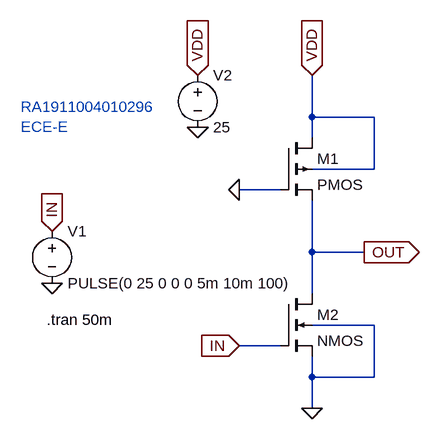
[diagram p0: schematic pseudo nmos.asc]
pseudo nmos.asc, the LTspice schematic file:
Version 4
SHEET 1 880 680
WIRE 256 32 256 -32
WIRE 352 32 256 32
WIRE 256 64 256 32
WIRE 352 112 352 32
WIRE 352 112 256 112
WIRE 208 144 144 144
WIRE 256 240 256 160
WIRE 336 240 256 240
WIRE 256 304 256 240
WIRE 352 352 256 352
WIRE 208 384 144 384
WIRE 256 432 256 400
WIRE 352 432 352 352
WIRE 352 432 256 432
WIRE 256 480 256 432
FLAG 336 240 OUT
IOPIN 336 240 Out
FLAG 144 384 IN
IOPIN 144 384 In
FLAG 144 144 0
FLAG 256 -32 VDD
IOPIN 256 -32 In
FLAG 256 480 0
FLAG 80 -32 VDD
IOPIN 80 -32 In
FLAG 80 48 0
FLAG -144 288 0
FLAG -144 208 IN
IOPIN -144 208 In
SYMBOL pmos4 208 64 R0
SYMATTR InstName M1
SYMBOL nmos4 208 304 R0
SYMATTR InstName M2
SYMBOL voltage -144 192 R0
WINDOW 123 0 0 Left 0
WINDOW 39 0 0 Left 0
SYMATTR InstName V1
SYMATTR Value PULSE(0 25 0 0 0 5m 10m 100)
SYMBOL voltage 80 -48 R0
WINDOW 123 0 0 Left 0
WINDOW 39 0 0 Left 0
SYMATTR InstName V2
SYMATTR Value 25
TEXT -152 344 Left 2 !.tran 50m
TEXT -192 16 Left 2 ;RA1911004010296\nECE-E

The netlist it stands for:
* pseudo nmos.asc
M1 VDD 0 OUT VDD PMOS
M2 OUT IN 0 0 NMOS
V1 IN 0 PULSE(0 25 0 0 0 5m 10m 100)
V2 VDD 0 25
.model NMOS NMOS
.model PMOS PMOS
.lib standard.mos
.tran 50m
* RA1911004010296
* ECE-E
.backanno
.end